# EAGLE schematic Versa64Cart_v1_2 (EAGLE 9.2.2)
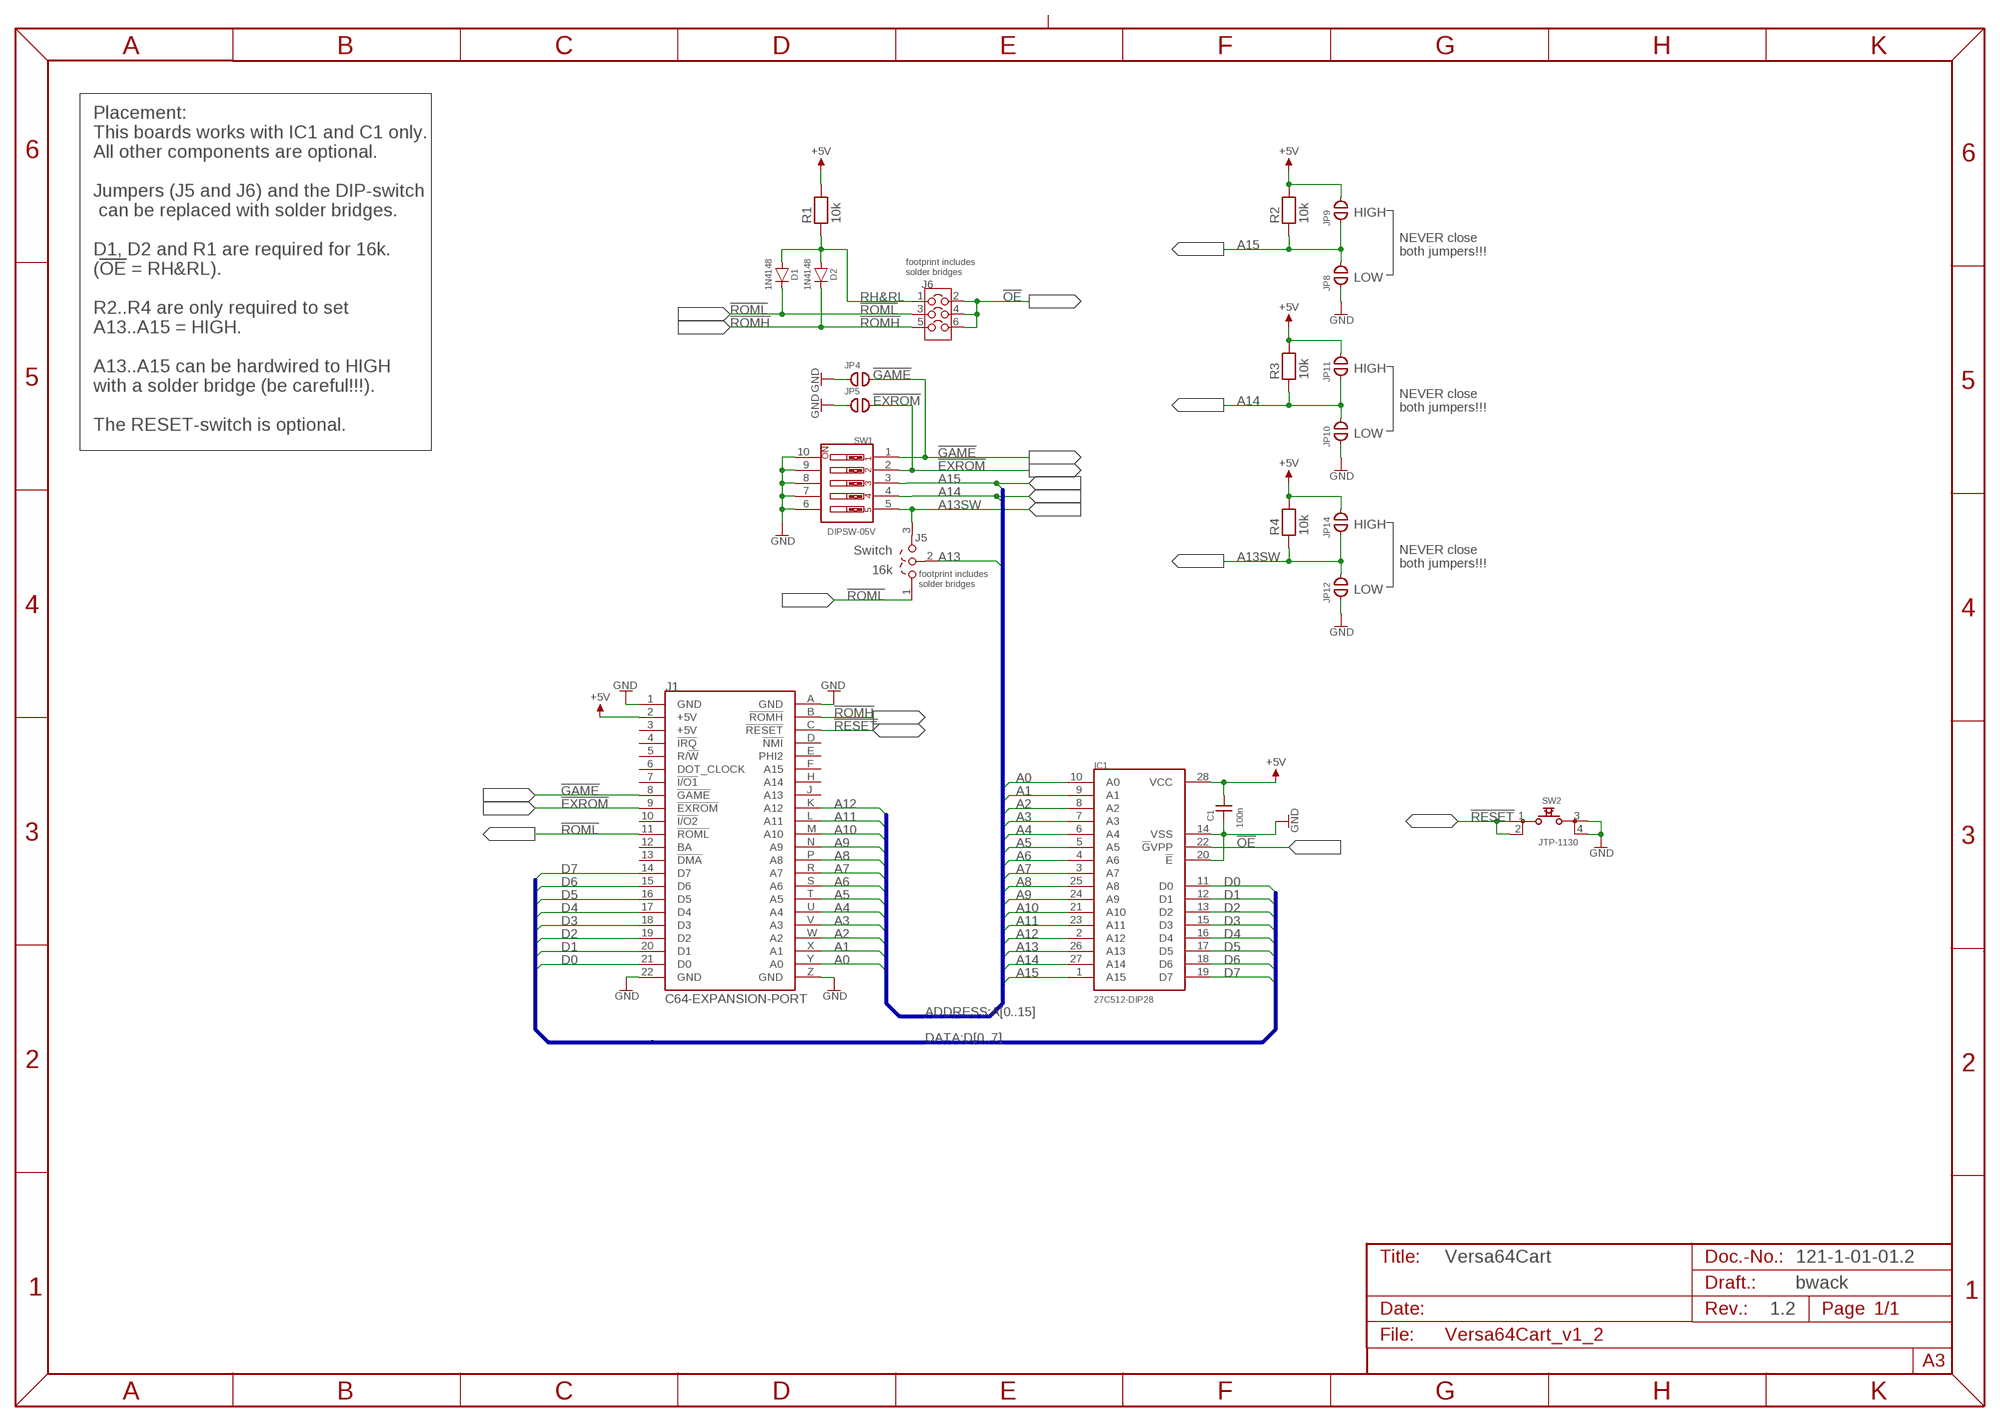
[diagram p0: schematic, sheet 1]

## Parts
C1  100n  CAP01  [C-2,5]
D1  1N4148  [DO-35]
D2  1N4148  [DO-35]
IC1  27C512-DIP28  M27C512-DIP28  [DIL28-6]
J1  C64-EXPANSION-PORT  C64-EXPANSIONP  [EXPPORT]
J5  COMBI-3P  [COMBI-3P]
J6  COMBI-3X2P  [COMBI-3X2]
JP4  OPEN  [CP_OP]
JP5  OPEN  [CP_OP]
JP8  OPEN  [CP_OP]
JP9  OPEN  [CP_OP]
JP10  OPEN  [CP_OP]
JP11  OPEN  [CP_OP]
JP12  OPEN  [CP_OP]
JP14  OPEN  [CP_OP]
R1  10k  RES04  [R-10]
R2  10k  RES04  [R-10]
R3  10k  RES04  [R-10]
R4  10k  RES04  [R-10]
SW1  DIPSW-05V  [DIPSW-05V]
SW2  JTP-1130  [JTP-1130]

## Nets
!EXROM: J1.9(!EXROM) JP5.2 SW1.2
!GAME: J1.8(!GAME) JP4.2 SW1.1
!OE: IC1.22(!G!VPP) J6.2 J6.4 J6.6
!RESET: J1.C(!RESET) SW2.1 SW2.2
!ROMH: D2.K J1.B(!ROMH) J6.5
!ROML: D1.K J1.11(!ROML) J5.1 J6.3
+5V: C1.2 IC1.28(VCC) J1.2(+5V) JP9.2 JP11.2 JP14.2 R1.2 R2.2 R3.2 R4.2
A0: IC1.10(A0) J1.Y(A0)
A1: IC1.9(A1) J1.X(A1)
A2: IC1.8(A2) J1.W(A2)
A3: IC1.7(A3) J1.V(A3)
A4: IC1.6(A4) J1.U(A4)
A5: IC1.5(A5) J1.T(A5)
A6: IC1.4(A6) J1.S(A6)
A7: IC1.3(A7) J1.R(A7)
A8: IC1.25(A8) J1.P(A8)
A9: IC1.24(A9) J1.N(A9)
A10: IC1.21(A10) J1.M(A10)
A11: IC1.23(A11) J1.L(A11)
A12: IC1.2(A12) J1.K(A12)
A13: IC1.26(A13) J5.2
A13SW: J5.3 JP12.2 JP14.1 R4.1 SW1.5
A14: IC1.27(A14) JP10.2 JP11.1 R3.1 SW1.4
A15: IC1.1(A15) JP8.2 JP9.1 R2.1 SW1.3
D0: IC1.11(D0) J1.21(D0)
D1: IC1.12(D1) J1.20(D1)
D2: IC1.13(D2) J1.19(D2)
D3: IC1.15(D3) J1.18(D3)
D4: IC1.16(D4) J1.17(D4)
D5: IC1.17(D5) J1.16(D5)
D6: IC1.18(D6) J1.15(D6)
D7: IC1.19(D7) J1.14(D7)
GND: C1.1 IC1.14(VSS) IC1.20(!E) J1.1(GND) J1.22(GND) J1.A(GND) J1.Z(GND) JP4.1 JP5.1 JP8.1 JP10.1 JP12.1 SW1.6 SW1.7 SW1.8 SW1.9 SW1.10 SW2.3 SW2.4
RH&RL: D1.A D2.A J6.1 R1.1
Unconnected: J1.4(!IRQ) J1.5(R/!W) J1.6(DOT_CLOCK) J1.7(!I/O1) J1.10(!I/O2) J1.12(BA) J1.13(!DMA) J1.D(!NMI) J1.E(PHI2) J1.F(A15) J1.H(A14) J1.J(A13)

## Buses
DATA:D[0..7]
ADDRESS:A[0..15]

## Notes on the sheet
- HIGH
- NEVER close
  both jumpers!!!
- footprint includes
  solder bridges
- LOW
- HIGH
- NEVER close
  both jumpers!!!
- Placement:
  This boards works with IC1 and C1 only. 
  All other components are optional.
  
  Jumpers (J5 and J6) and the DIP-switch
   can be replaced with solder bridges.
  
  D1, D2 and R1 are required for 16k. 
  (!OE! = RH&RL).
  
  R2..R4 are only required to set
  A13..A15 = HIGH.
  
  A13..A15 can be hardwired to HIGH 
  with a solder bridge (be careful!!!).
  
  The RESET-switch is optional.
- LOW
- HIGH
- Switch
- NEVER close
  both jumpers!!!
- 16k
- footprint includes
  solder bridges
- LOW
- Versa64Cart | 121-1-01-01.2
- bwack
- 1.2

## Power pins joined to a net without a drawn wire
+5V: J1.3(+5V)

## Library data of the parts
C1 = DISCRETE:CAP01
D1 D2 = Dioden:1N4148
IC1 = ST:M27C512
J1 = Commodore:C64-EXPANSIONP
J5 = Cutpad:COMBI-3P
J6 = Cutpad:COMBI-3X2P; SPICEPREFIX: X
JP4 JP5 JP8-JP12 JP14 = Cutpad:OPEN: open Cutpad
R1-R4 = DISCRETE:RES04
SW1 = DIPSWITCH:DIPSW-05
SW2 = Namae_Electronics:JTP-1130